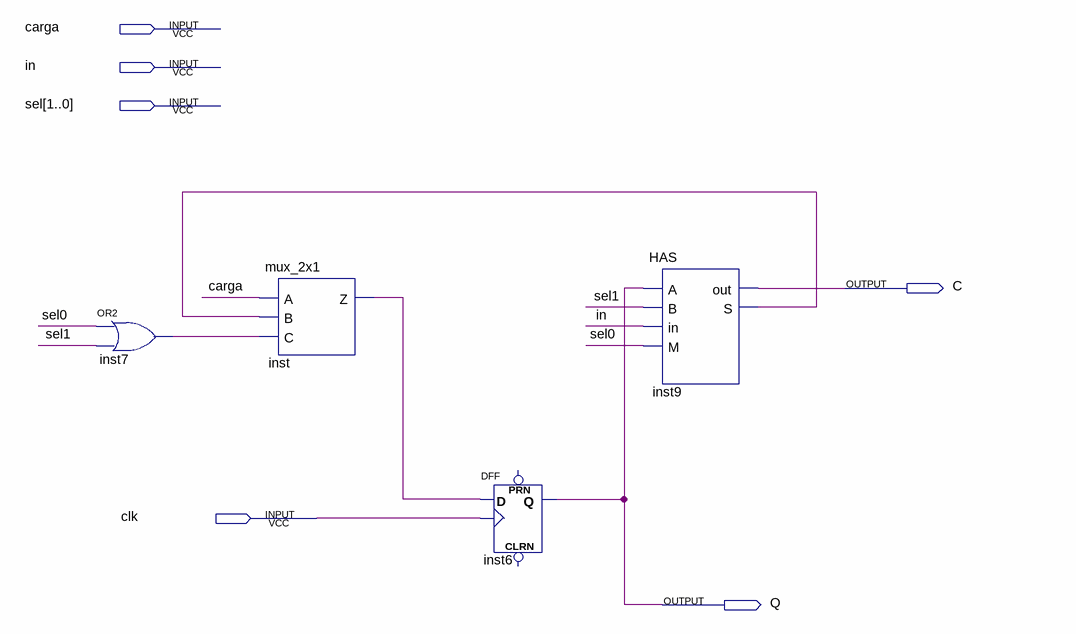
[diagram p0: schematic sheet]
// Quartus schematic contador.bdf as structural Verilog: 4 symbols, 6 pins
module contador (
  input  carga,
  input  in,
  input  [1:0] sel,
  input  clk,
  output C,
  output Q
);

  wire inst7_out, inst9_s, inst_z;

  or inst7 (inst7_out, sel[0], sel[1]);
  mux_2x1 inst (.A(carga), .B(inst9_s), .C(inst7_out), .Z(inst_z));
  DFF inst6 (.CLK(clk), .D(inst_z), .Q(Q));  // open: CLRN, PRN
  HAS inst9 (.A(Q), .B(sel[1]), .in(in), .M(sel[0]), .out(C), .S(inst9_s));
endmodule
